# EAGLE design ESP32_sparrow_old_good (EAGLE 9.6.2)

## Sheet 1 of 2
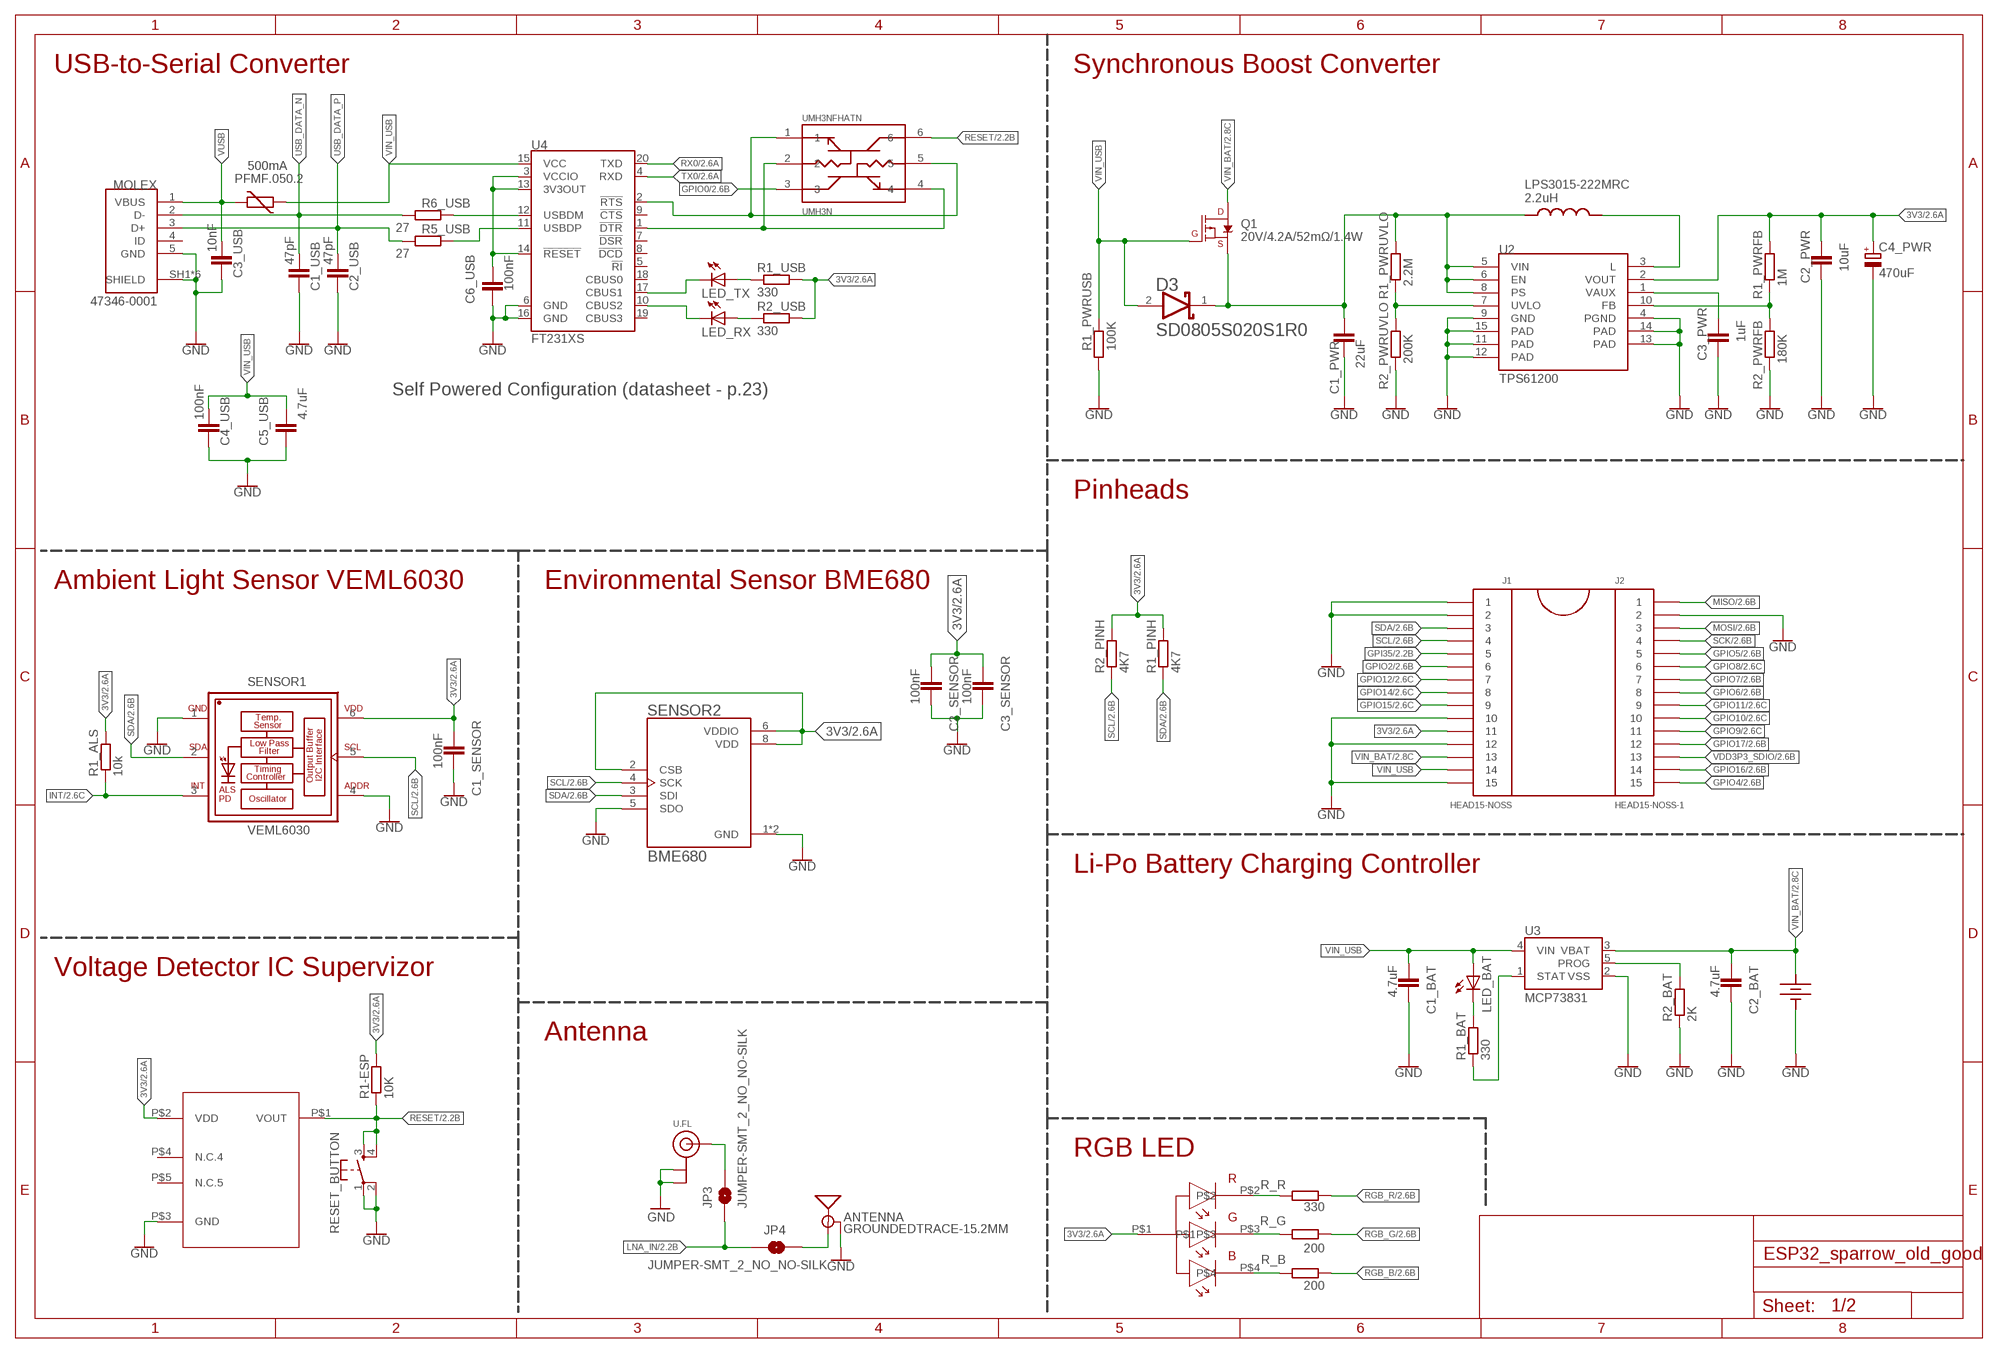
[diagram p0: schematic, sheet 1]

### Parts
ANTENNA  GROUNDEDTRACE-15.2MM  ANTENNA-GROUNDEDTRACE-15.2MM  [TRACE_ANTENNA_2.4GHZ_15.2MM]
C1_BAT  4.7uF  CC0402  [C0402]
C1_PWR  22uF  C-EUC0603  [C0603]
C1_SENSOR  100nF  CC0402  [C0402]
C1_USB  47pF  CC0402  [C0402]
C2_BAT  4.7uF  CC0402  [C0402]
C2_PWR  10uF  CC0402  [C0402]
C2_SENSOR  100nF  CC0402  [C0402]
C2_USB  47pF  CC0402  [C0402]
C3_PWR  1uF  CC0402  [C0402]
C3_SENSOR  100nF  CC0402  [C0402]
C3_USB  10nF  CC0402  [C0402]
C4_PWR  470uF  CPOL-EUD/7343-31R  [D/7343-31R]
C4_USB  100nF  CC0402  [C0402]
C5_USB  4.7uF  CC0402  [C0402]
C6_USB  100nF  CC0402  [C0402]
D3  AVX_SD0805S020S1R0AVX_SD0805S020S1R0_0_0  [AVX_SD0805S020S1R0_0]
J1  HEAD15-NOSS  [HEAD15-NOSS]
J2  HEAD15-NOSS-1  [HEAD15-NOSS-1]
JP3  JUMPER-SMT_2_NO_NO-SILK  [SMT-JUMPER_2_NO_NO-SILK]
JP4  JUMPER-SMT_2_NO_NO-SILK  [SMT-JUMPER_2_NO_NO-SILK]
LED_BAT  LEDCHIP-LED0603  [CHIP-LED0603]
LED_RX  LEDCHIP-LED0603  [CHIP-LED0603]
LED_TX  LEDCHIP-LED0603  [CHIP-LED0603]
MOLEX  47346-0001  [MOLEX_47346-0001]
PFMF.050.2  500mA  VARISTORCN1812  [CT/CN1812]
Q1  20V/4.2A/52mΩ/1.4W  MOSFET_PCH-DMG2305UX-7  [SOT23-3]
R1-ESP  10K  RR0402  [R0402]
R1_ALS  10k  RR0402  [R0402]
R1_BAT  330  RR0402  [R0402]
R1_PINH  4K7  RR0402  [R0402]
R1_PWRFB  1M  RR0402  [R0402]
R1_PWRUSB  100K  RR0402  [R0402]
R1_PWRUVLO  2.2M  RR0402  [R0402]
R1_USB  330  RR0402  [R0402]
R2_BAT  2K  RR0402  [R0402]
R2_PINH  4K7  RR0402  [R0402]
R2_PWRFB  180K  RR0402  [R0402]
R2_PWRUVLO  200K  RR0402  [R0402]
R2_USB  330  RR0402  [R0402]
R5_USB  27  RR0402  [R0402]
R6_USB  27  RR0402  [R0402]
R_B  200  RR0402  [R0402]
R_G  200  RR0402  [R0402]
R_R  330  RR0402  [R0402]
RESET_BUTTON  MOMENTARY-SWITCH-SPST-2-SMD-4.6X2.8MM  [TACTILE_SWITCH_SMD_4.6X2.8MM]
SENSOR1  VEML6030  [VISHAY_VEML6030_2X2X0.87]
SENSOR2  BME680  [PSON80P300X300X100-8N]
U2  TPS61200  [QFN-10_PAD]
U3  MCP73831  [SOT23-5]
U4  FT231XS  [SSOP20_L]
U$1  150202M153130-RGB  [150202M153130]
U$2  BD48E27G-TR  [SSOP5]
U$4  12BHC186CLP-GR  [12BHC186CLP-GR]
U$5  LPS3015  [LPS3015-222MRC]
U.FL  ANTENNA_U.FL  [U.FL]
UMH3NFHATN  UMH3NFHATN  UMH3N  [SOP65P210X100-6N]

### Nets
3V3: C1_SENSOR.2 C2_PWR.2 C2_SENSOR.2 C3_SENSOR.2 C4_PWR.+ J1.11 R1-ESP.2 R1_ALS.2 R1_PINH.2 R1_PWRFB.2 R1_USB.2 R2_PINH.2 R2_USB.2 SENSOR1.6(VDD) SENSOR2.2(CSB) SENSOR2.6(VDDIO) SENSOR2.8(VDD) U2.2(VOUT) U$1.P$1 U$2.P$2(VDD) ; also sheet 2
GND: ANTENNA.GND C1_BAT.1 C1_PWR.2 C1_SENSOR.1 C1_USB.2 C2_BAT.1 C2_PWR.1 C2_SENSOR.1 C2_USB.2 C3_PWR.1 C3_SENSOR.1 C3_USB.2 C4_PWR.- C4_USB.2 C5_USB.2 C6_USB.2 J1.1 J1.2 J1.10 J1.12 J1.15 J2.2 MOLEX.5(GND) MOLEX.SH1(SHIELD) MOLEX.SH2(SHIELD) MOLEX.SH3(SHIELD) MOLEX.SH4(SHIELD) MOLEX.SH5(SHIELD) MOLEX.SH6(SHIELD) R1_PWRUSB.1 R2_BAT.1 R2_PWRFB.1 R2_PWRUVLO.1 RESET_BUTTON.1 RESET_BUTTON.2 SENSOR1.1(GND) SENSOR1.4(ADDR) SENSOR2.1(GND) SENSOR2.5(SDO) SENSOR2.7(GND) U2.4(PGND) U2.9(GND) U2.11(PAD) U2.12(PAD) U2.13(PAD) U2.14(PAD) U2.15(PAD) U3.2(VSS) U4.6(GND) U4.16(GND) U$2.P$3(GND) U$4.P$1(G) U$4.P$3(G) U$4.P$4(G) U.FL.1(GND) U.FL.2(GND) ; also sheet 2
GPI35: J1.5 ; also sheet 2
GPIO0: UMH3NFHATN.3 ; also sheet 2
GPIO2: J1.6 ; also sheet 2
GPIO4: J2.15 ; also sheet 2
GPIO5: J2.5 ; also sheet 2
GPIO6: J2.8 ; also sheet 2
GPIO7: J2.7 ; also sheet 2
GPIO8: J2.6 ; also sheet 2
GPIO9: J2.11 ; also sheet 2
GPIO10: J2.10 ; also sheet 2
GPIO11: J2.9 ; also sheet 2
GPIO12: J1.7 ; also sheet 2
GPIO14: J1.8 ; also sheet 2
GPIO15: J1.9 ; also sheet 2
GPIO16: J2.14 ; also sheet 2
GPIO17: J2.12 ; also sheet 2
INT: R1_ALS.1 SENSOR1.3(INT) ; also sheet 2
LNA_IN: JP3.1 JP4.1 ; also sheet 2
MISO: J2.1 ; also sheet 2
MOSI: J2.3 ; also sheet 2
N$1: R1_PWRFB.1 R2_PWRFB.2 U2.10(FB)
N$3: R_B.2 U$1.P$4
N$4: R_G.2 U$1.P$3
N$5: R_R.2 U$1.P$2
N$6: U4.1(!DTR) UMH3NFHATN.2 UMH3NFHATN.4
N$7: U4.2(!RTS) UMH3NFHATN.1 UMH3NFHATN.5
N$8: ANTENNA.ANT(SIGNAL) JP4.2
N$9: C6_USB.1 U4.3(VCCIO) U4.13(3V3OUT) U4.14(!RESET)
N$10: R1_PWRUVLO.1 R2_PWRUVLO.2 U2.7(UVLO)
N$12: U2.3(L) U$5.P$2
N$13: LED_BAT.C R1_BAT.2
N$15: R1_BAT.1 U3.1(STAT)
N$16: LED_TX.C U4.17(CBUS1)
N$18: JP3.2 U.FL.3(SIGNAL)
N$19: C3_PWR.2 U2.1(VAUX)
N$20: R6_USB.2 U4.12(USBDM)
N$22: LED_TX.A R1_USB.1
N$23: LED_RX.C U4.10(CBUS2)
N$24: LED_RX.A R2_USB.1
N$26: R5_USB.2 U4.11(USBDP)
N$28: R2_BAT.2 U3.5(PROG)
RESET: R1-ESP.1 RESET_BUTTON.3 RESET_BUTTON.4 U$2.P$1(VOUT) UMH3NFHATN.6 ; also sheet 2
RGB_B: R_B.1 ; also sheet 2
RGB_G: R_G.1 ; also sheet 2
RGB_R: R_R.1 ; also sheet 2
RX0: U4.20(TXD) ; also sheet 2
SCK: J2.4 ; also sheet 2
SCL: J1.4 R2_PINH.1 SENSOR1.5(SCL) SENSOR2.4(SCK) ; also sheet 2
SDA: J1.3 R1_PINH.1 SENSOR1.2(SDA) SENSOR2.3(SDI) ; also sheet 2
TX0: U4.4(RXD) ; also sheet 2
USB_DATA_N: C1_USB.1 MOLEX.2(D-) R6_USB.1
USB_DATA_P: C2_USB.1 MOLEX.3(D+) R5_USB.1
VDD3P3_SDIO: J2.13 ; also sheet 2
VIN: C1_PWR.1 D3.1(CATHODE) Q1.2(S) R1_PWRUVLO.2 U2.5(VIN) U2.6(EN) U2.8(PS) U$5.P$1
VIN_BAT: C2_BAT.2 J1.13 Q1.3(D) U3.3(VBAT) U$4.P$2(P) U$4.P$5(P) U$4.P$6(P) ; also sheet 2
VIN_USB: C1_BAT.2 C4_USB.1 C5_USB.1 D3.2(ANODE) J1.14 LED_BAT.A PFMF.050.2.1 Q1.1(G) R1_PWRUSB.2 U3.4(VIN) U4.15(VCC)
VUSB: C3_USB.1 MOLEX.1(VBUS) PFMF.050.2.2
Unconnected: MOLEX.4(ID) U4.5(!RI) U4.7(!DSR) U4.8(!DCD) U4.9(!CTS) U4.18(CBUS0) U4.19(CBUS3) U$2.P$4(N.C.4) U$2.P$5(N.C.5)

### Notes on the sheet
- USB-to-Serial Converter | Synchronous Boost Converter
- Self Powered Configuration (datasheet - p.23)
- Pinheads
- Ambient Light Sensor VEML6030 | Environmental Sensor BME680
- Li-Po Battery Charging Controller
- Voltage Detector IC Supervizor
- Antenna
- RGB LED

## Sheet 2 of 2
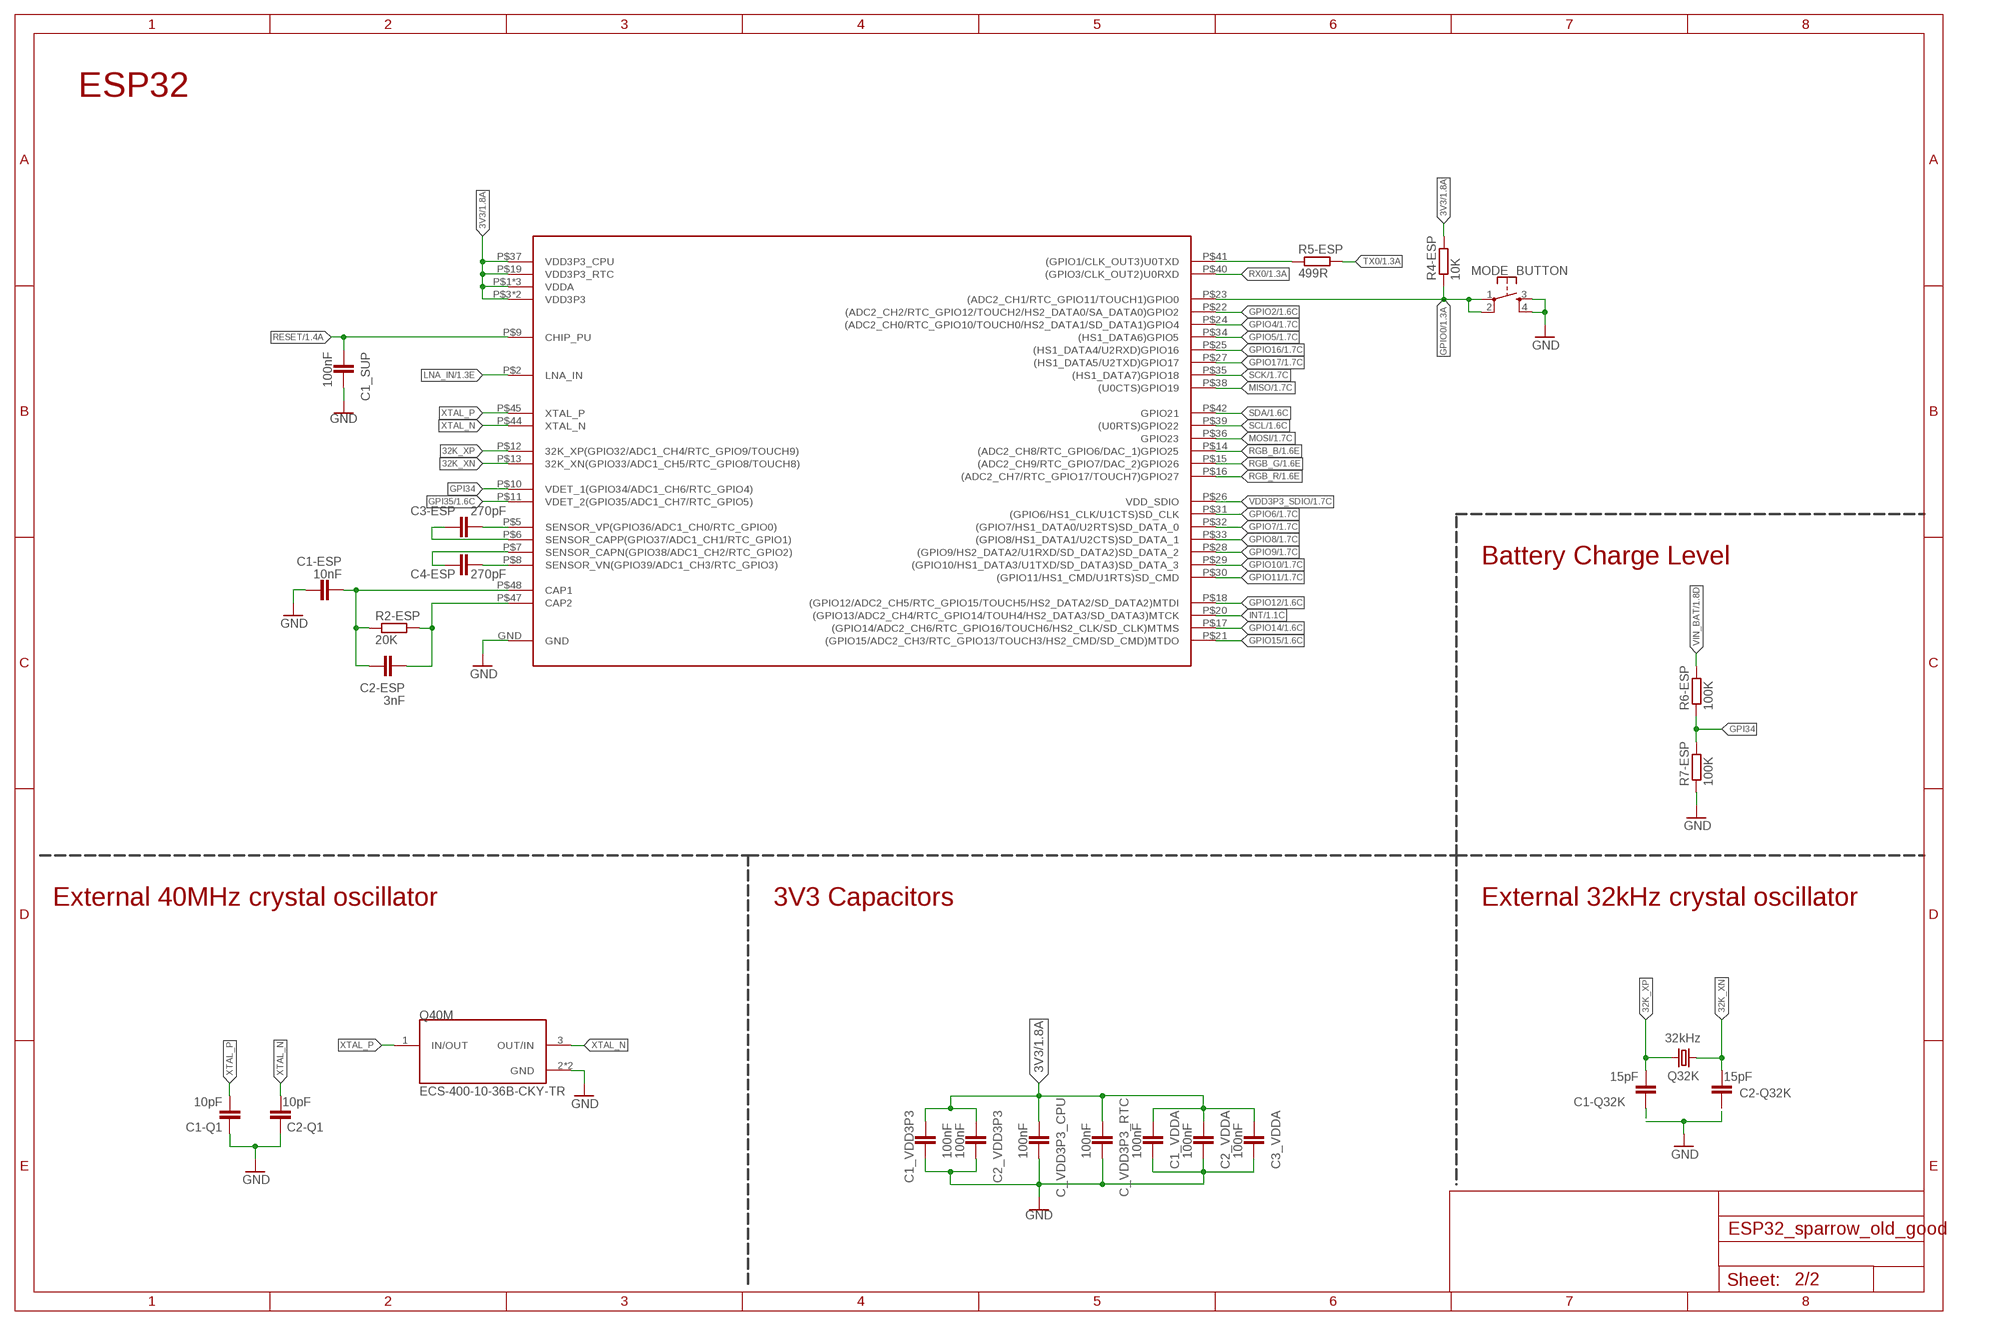
[diagram p1: schematic, sheet 2]

### Parts
C1-ESP  10nF  CC0402  [C0402]
C1-Q1  10pF  CC0402  [C0402]
C1-Q32K  15pF  CC0402  [C0402]
C1_SUP  100nF  CC0402  [C0402]
C1_VDD3P3  100nF  CC0402  [C0402]
C1_VDDA  100nF  CC0402  [C0402]
C2-ESP  3nF  CC0402  [C0402]
C2-Q1  10pF  CC0402  [C0402]
C2-Q32K  15pF  CC0402  [C0402]
C2_VDD3P3  100nF  CC0402  [C0402]
C2_VDDA  100nF  CC0402  [C0402]
C3-ESP  270pF  CC0402  [C0402]
C3_VDDA  100nF  CC0402  [C0402]
C4-ESP  270pF  CC0402  [C0402]
C_VDD3P3_CPU  100nF  CC0402  [C0402]
C_VDD3P3_RTC  100nF  CC0402  [C0402]
MODE_BUTTON  MOMENTARY-SWITCH-SPST-2-SMD-4.6X2.8MM  [TACTILE_SWITCH_SMD_4.6X2.8MM]
Q32K  32kHz  FC-12M  [FC-12M]
Q40M  ECS-400-10-36B-CKY-TR  [XTAL_ECS-163.84-10-36-JGN-TR]
R2-ESP  20K  RR0402  [R0402]
R4-ESP  10K  RR0402  [R0402]
R5-ESP  499R  RR0402  [R0402]
R6-ESP  100K  RR0402  [R0402]
R7-ESP  100K  RR0402  [R0402]
U$3  ESP32-U4WDH  [ESP32-U4WDH]

### Nets
3V3: C1_VDD3P3.2 C1_VDDA.2 C2_VDD3P3.2 C2_VDDA.2 C3_VDDA.2 C_VDD3P3_CPU.2 C_VDD3P3_RTC.2 R4-ESP.2 U$3.P$1(VDDA) U$3.P$3(VDD3P3) U$3.P$4(VDD3P3) U$3.P$19(VDD3P3_RTC) U$3.P$37(VDD3P3_CPU) U$3.P$43(VDDA) U$3.P$46(VDDA) ; also sheet 1
32K_XN: C2-Q32K.2 Q32K.1 U$3.P$13(32K_XN(GPIO33/ADC1_CH5/RTC_GPIO8/TOUCH8))
32K_XP: C1-Q32K.2 Q32K.2 U$3.P$12(32K_XP(GPIO32/ADC1_CH4/RTC_GPIO9/TOUCH9))
GND: C1-ESP.1 C1-Q1.1 C1-Q32K.1 C1_SUP.1 C1_VDD3P3.1 C1_VDDA.1 C2-Q1.1 C2-Q32K.1 C2_VDD3P3.1 C2_VDDA.1 C3_VDDA.1 C_VDD3P3_CPU.1 C_VDD3P3_RTC.1 MODE_BUTTON.3 MODE_BUTTON.4 Q40M.2(GND) Q40M.4(GND) R7-ESP.1 U$3.GND ; also sheet 1
GPI34: R6-ESP.1 R7-ESP.2 U$3.P$10(VDET_1(GPIO34/ADC1_CH6/RTC_GPIO4))
GPI35: U$3.P$11(VDET_2(GPIO35/ADC1_CH7/RTC_GPIO5)) ; also sheet 1
GPIO0: MODE_BUTTON.1 MODE_BUTTON.2 R4-ESP.1 U$3.P$23((ADC2_CH1/RTC_GPIO11/TOUCH1)GPIO0) ; also sheet 1
GPIO2: U$3.P$22((ADC2_CH2/RTC_GPIO12/TOUCH2/HS2_DATA0/SA_DATA0)GPIO2) ; also sheet 1
GPIO4: U$3.P$24((ADC2_CH0/RTC_GPIO10/TOUCH0/HS2_DATA1/SD_DATA1)GPIO4) ; also sheet 1
GPIO5: U$3.P$34((HS1_DATA6)GPIO5) ; also sheet 1
GPIO6: U$3.P$31((GPIO6/HS1_CLK/U1CTS)SD_CLK) ; also sheet 1
GPIO7: U$3.P$32((GPIO7/HS1_DATA0/U2RTS)SD_DATA_0) ; also sheet 1
GPIO8: U$3.P$33((GPIO8/HS1_DATA1/U2CTS)SD_DATA_1) ; also sheet 1
GPIO9: U$3.P$28((GPIO9/HS2_DATA2/U1RXD/SD_DATA2)SD_DATA_2) ; also sheet 1
GPIO10: U$3.P$29((GPIO10/HS1_DATA3/U1TXD/SD_DATA3)SD_DATA_3) ; also sheet 1
GPIO11: U$3.P$30((GPIO11/HS1_CMD/U1RTS)SD_CMD) ; also sheet 1
GPIO12: U$3.P$18((GPIO12/ADC2_CH5/RTC_GPIO15/TOUCH5/HS2_DATA2/SD_DATA2)MTDI) ; also sheet 1
GPIO14: U$3.P$17((GPIO14/ADC2_CH6/RTC_GPIO16/TOUCH6/HS2_CLK/SD_CLK)MTMS) ; also sheet 1
GPIO15: U$3.P$21((GPIO15/ADC2_CH3/RTC_GPIO13/TOUCH3/HS2_CMD/SD_CMD)MTDO) ; also sheet 1
GPIO16: U$3.P$25((HS1_DATA4/U2RXD)GPIO16) ; also sheet 1
GPIO17: U$3.P$27((HS1_DATA5/U2TXD)GPIO17) ; also sheet 1
INT: U$3.P$20((GPIO13/ADC2_CH4/RTC_GPIO14/TOUH4/HS2_DATA3/SD_DATA3)MTCK) ; also sheet 1
LNA_IN: U$3.P$2(LNA_IN) ; also sheet 1
MISO: U$3.P$38((U0CTS)GPIO19) ; also sheet 1
MOSI: U$3.P$36(GPIO23) ; also sheet 1
N$2: R5-ESP.1 U$3.P$41((GPIO1/CLK_OUT3)U0TXD)
N$11: C1-ESP.2 C2-ESP.1 R2-ESP.1 U$3.P$48(CAP1)
N$14: C2-ESP.2 R2-ESP.2 U$3.P$47(CAP2)
N$34: C3-ESP.1 U$3.P$6(SENSOR_CAPP(GPIO37/ADC1_CH1/RTC_GPIO1))
N$35: C3-ESP.2 U$3.P$5(SENSOR_VP(GPIO36/ADC1_CH0/RTC_GPIO0))
N$36: C4-ESP.1 U$3.P$7(SENSOR_CAPN(GPIO38/ADC1_CH2/RTC_GPIO2))
N$38: C4-ESP.2 U$3.P$8(SENSOR_VN(GPIO39/ADC1_CH3/RTC_GPIO3))
RESET: C1_SUP.2 U$3.P$9(CHIP_PU) ; also sheet 1
RGB_B: U$3.P$14((ADC2_CH8/RTC_GPIO6/DAC_1)GPIO25) ; also sheet 1
RGB_G: U$3.P$15((ADC2_CH9/RTC_GPIO7/DAC_2)GPIO26) ; also sheet 1
RGB_R: U$3.P$16((ADC2_CH7/RTC_GPIO17/TOUCH7)GPIO27) ; also sheet 1
RX0: U$3.P$40((GPIO3/CLK_OUT2)U0RXD) ; also sheet 1
SCK: U$3.P$35((HS1_DATA7)GPIO18) ; also sheet 1
SCL: U$3.P$39((U0RTS)GPIO22) ; also sheet 1
SDA: U$3.P$42(GPIO21) ; also sheet 1
TX0: R5-ESP.2 ; also sheet 1
VDD3P3_SDIO: U$3.P$26(VDD_SDIO) ; also sheet 1
VIN_BAT: R6-ESP.2 ; also sheet 1
XTAL_N: C2-Q1.2 Q40M.3(OUT/IN) U$3.P$44(XTAL_N)
XTAL_P: C1-Q1.2 Q40M.1(IN/OUT) U$3.P$45(XTAL_P)

### Notes on the sheet
- ESP32
- Battery Charge Level
- External 40MHz crystal oscillator | 3V3 Capacitors | External 32kHz crystal oscillator

## Library data of the parts
ANTENNA = SparkFun-RF:ANTENNA-GROUNDED: Antenna w/ Ground Connection 2.4GHz antennae with signal and ground terminals. TRACE_ANTENNA_2.4GHZ_15.2MM - Meander Trace antenna 15.2 x 5.7mm footprint Based on layout from TI app note AN043 <http://www.ti.com/lit/an/swra117d/swra117d.pdf>. TRACE_ANTENNA_2.4GHZ_25.7MM - Inverted F trace antenna 25.7 x 7.5 mm footprint. Based on layout from TI design note DN0007 <http://www.ti.com/lit/an/swru120b/swru120b.pdf>.
C1-ESP C1-Q1 C1-Q32K C1_BAT C1_SENSOR C1_SUP C1_USB C1_VDD3P3 C1_VDDA C2-ESP C2-Q1 C2-Q32K C2_BAT C2_PWR C2_SENSOR C2_USB C2_VDD3P3 C2_VDDA C3-ESP C3_PWR C3_SENSOR C3_USB C3_VDDA C4-ESP C4_USB C5_USB C6_USB C_VDD3P3_CPU C_VDD3P3_RTC = eagle-ltspice:C: CAPACITOR, European symbol; SPICEMODEL: NONE; SPICEPREFIX: C
C1_PWR = rcl:C-EU: CAPACITOR, European symbol; SPICEPREFIX: C
C4_PWR = rcl:CPOL-EU: POLARIZED CAPACITOR, European symbol; SPICEPREFIX: C
D3 = AVX - SD0805S020S1R0:AVX_SD0805S020S1R0: Schottky Barrier Rectifier Diode; CENTROID_NOT_SPECIFIED: No; DATASHEET: http://datasheets.avx.com/schottky.pdf; DIGIKEY_DESCRIPTION: DIODE SCHOTTKY 20V 1A 0805; DIGIKEY_PART_NUMBER: 478-7800-1-ND; LEAD_FREE: yes; MF: AVX; MOUSER_PART_NUMBER: 581-SD0805S020S1R0; MPN: SD0805S020S1R0; PACKAGE: 0805 (2012 metric); PREFIX: D; ROHS: yes; TEMPERATURE_RANGE_HIGH: +125°C; TEMPERATURE_RANGE_LOW: -55°C
J1 = MyCON2:HEAD15-NOSS
J2 = MyCON2:HEAD15-NOSS-1
JP3 JP4 = SparkFun-Jumpers:JUMPER-SMT_2_NO: Normally open jumper This jumper has two pads in close proximity to each other. Apply solder to close the connection. Round pads are easier to solder for beginners, but are a lot larger. SparkFun Product that uses the round pads: SparkFun EL Sequencer <https://www.sparkfun.com/products/12781>
LED_BAT LED_RX LED_TX = adafruit:LED: LED OSRAM: - CHIPLED LG R971, LG N971, LY N971, LG Q971, LY Q971, LO R971, LY R971 LH N974, LH R974 LS Q976, LO Q976, LY Q976 LO Q996 - Hyper CHIPLED LW Q18S LB Q993, LB Q99A, LB R99A - SideLED LS A670, LO A670, LY A670, LG A670, LP A670 LB A673, LV A673, LT A673, LW A673 LH A674 LY A675 LS A676, LA A676, LO A676, LY A676, LW A676 LS A679, LY A679, LG A679 - Hyper Micro SIDELED® LS Y876, LA Y876, LO Y876, LY Y876 LT Y87S - SmartLED LW L88C, LW L88S LB L89C, LB L89S, LG L890 LS L89K, LO L89K, LY L89K LS L896, LA L896, LO L896, LY L896 - TOPLED LS T670, LO T670, LY T670, LG T670, LP T670 LSG T670, LSP T670, LSY T670, LOP T670, LYG T670 LG T671, LOG T671, LSG T671 LB T673, LV T673, LT T673, LW T673 LH T674 LS T676, LA T676, LO T676, LY T676, LB T676, LH T676, LSB T676, LW T676 LB T67C, LV T67C, LT T67C, LS T67K, LO T67K, LY T67K, LW E67C LS E67B, LA E67B, LO E67B, LY E67B, LB E67C, LV E67C, LT E67C LW T67C LS T679, LY T679, LG T679 LS T770, LO T770, LY T770, LG T770, LP T770 LB T773, LV T773, LT T773, LW T773 LH T774 LS E675, LA E675, LY E675, LS T675 LS T776, LA T776, LO T776, LY T776, LB T776 LHGB T686 LT T68C, LB T68C - Hyper Mini TOPLED® LB M676 - Mini TOPLED Santana® LG M470 LS M47K, LO M47K, LY M47K Source: http://www.osram.convergy.de/
MODE_BUTTON RESET_BUTTON = SparkFun-Switches:MOMENTARY-SWITCH-SPST-2: Momentary Switch (Pushbutton) - SPST - Two Circuits Normally-open (NO) SPST momentary switches (buttons, pushbuttons). Schematic symbol includes two switch circuits. Variants SMD-4.6MMX2.8MM - 4.60mm x 2.80mm Tactile Momentary Button Switch - Used on SparkFun SAMD21 Mini Breakout <https://www.sparkfun.com/products/13664> SMD-5.2MM - Mini Pushbutton Switch - SMD <https://www.sparkfun.com/products/8720> - Used on Arduino Pro Mini <https://www.sparkfun.com/products/11114>; PROD_ID: SWCH-13065
MOLEX = 47346-0001:47346-0001: CONN RCPT 5POS MICRO USB R/A SMD Check prices <https://pricing.snapeda.com/parts/47346-0001/Molex/view-part?ref=eda>; AVAILABILITY: Warning; DESCRIPTION: USB - micro B USB 2.0 Receptacle Connector 5 Position Surface Mount, Right Angle; MF: Molex; MP: 47346-0001; PACKAGE: None; PRICE: None
PFMF.050.2 = varistor:VARISTOR: VARISTOR
Q1 = SparkFun-DiscreteSemi:MOSFET_PCH: P-channel MOSFETs Voltage controlled devices that allow control of high current outputs. SparkFun Products: SparkFun ESP32 Thing <https://www.sparkfun.com/products/13907> SparkFun ESP8266 Thing <https://www.sparkfun.com/products/13231> SparkFun Pi Servo HAT V2 <https://www.sparkfun.com/products/15316> DMG2305UX-7 (20V/4.2A/SOT23-3); PROD_ID: TRAN-14388
Q32K = crystal:FC-12M: kHz RANGE CRYSTAL UNIT LOW PROFILE SMD Source: Epson Toyocom FC-12M.pdf
Q40M = ECS-400-10-36B-CKY-TR:ECS-400-10-36B-CKY-TR: The minature ECX-2236 is a compact SMD Crystal. The industry standard 2.5 x 2.0 x 0.55 mm ceramic package is ideal for today’s SMD manufacturing environment. Check prices <https://pricing.snapeda.com/parts/ECS-400-10-36B-CKY-TR/ECS%20Inc./view-part?ref=eda>; AVAILABILITY: Warning; DESCRIPTION: 40MHz ±10ppm Crystal 10pF 30 Ohms 4-SMD, No Lead; MF: ECS Inc.; MP: ECS-400-10-36B-CKY-TR; PACKAGE: SMD-4 ECS International; PRICE: None; PURCHASE-URL: https://pricing.snapeda.com/search/part/ECS-400-10-36B-CKY-TR/?ref=eda
R1-ESP R1_ALS R1_BAT R1_PINH R1_PWRFB R1_PWRUSB R1_PWRUVLO R1_USB R2-ESP R2_BAT R2_PINH R2_PWRFB R2_PWRUVLO R2_USB R4-ESP R5-ESP R5_USB R6-ESP R6_USB R7-ESP R_B R_G R_R = eagle-ltspice:R: RESISTOR, European symbol; SPICEMODEL: NONE; SPICEPREFIX: R
SENSOR1 = VEML6030:VEML6030: VEML6030 High Accuracy Ambient Light Sensor with I2C Interface: VEML6030 is a high accuracy ambient light digital 16-bit resolution sensor in a miniature transparent 2 mm x 2 mm package. It includes a high sensitive photodiode, a low noise amplifier, a 16-bit A/D converter and supports an easy to use I2C bus communication interface and additional interrupt feature. The ambient light result is as digital value available. Device Model created 15.06.2016 by Johannes Kolb - Vishay Semiconductor GmbH Check prices <https://pricing.snapeda.com/parts/VEML6030/Vishay/view-part?ref=eda>; AVAILABILITY: In Stock; DESCRIPTION: Optical Sensor Ambient 550nm I²C 6-SMD, No Lead; MF: Vishay; MP: VEML6030; PACKAGE: SMD-6 Vishay; PRICE: None
SENSOR2 = BME680:BME680: Integrated Environmental Unit; AVAILABILITY: Unavailable; DESCRIPTION: Integrated Environmental Unit; MF: Bosch Sensortec; MP: BME680; PACKAGE: LGA-8 Bosch Tools; PRICE: None
U2 = SparkFun-IC-Power:TPS61200: DC to DC Booster IC-10035; PROD_ID: IC-10035
U3 = SparkFun-IC-Power:MCP73831: MCP73831T Li-Ion, Li-Pol Controller Miniature single cell, fully integrated Li-Ion, Li-polymer charge management controller Datasheet <http://ww1.microchip.com/downloads/en/DeviceDoc/20001984g.pdf> SparkFun Products: SparkFun ESP32 Thing <https://www.sparkfun.com/products/13907> SparkFun 9DoF Razor IMU M0 <https://www.sparkfun.com/products/14001>; PROD_ID: IC-09995
U4 = SparkFun-IC-Comms:FT231X: FTDI FT231X Full Speed USB to Full-handshake UART This USB2.0 Full Speed IC offers a compact bridge to full handshake UART interfaces. The device is a UART, capable of operating up to 3MBaud, with low power consumption (8mA). The FT231X includes the complete FT-X series feature set and enables USB to be added into a system design quickly and easily over a UART interface. Datasheet <http://cdn.sparkfun.com/datasheets/Components/General%20IC/DS_FT231X.pdf> SparkFun Products SparkFun RedBoard - Programmed with Arduino <https://www.sparkfun.com/products/12757> (DEV-12757) SparkFun XBee Explorer USB <https://www.sparkfun.com/products/11812> (WRL-11812) SparkFun XBee Explorer Dongle <https://www.sparkfun.com/products/11697> (WRL-11697) SparkFun Blynk Board - ESP8266 <https://www.sparkfun.com/products/13794> (WRL-13794) SparkFun ESP8266 Thing - Dev Board <https://www.sparkfun.com/products/13711> (WRL-13711) SparkFun Block for Intel® Edison - Base <https://www.sparkfun.com/products/13045> (DEV-13045) SparkFun RedStick <https://www.sparkfun.com/products/13741> (DEV-13741) SparkFun Beefy 3 - FTDI Basic Breakout <https://www.sparkfun.com/products/13746> (DEV-13746) SparkFun FT231X Breakout <https://www.sparkfun.com/products/11736> (BOB-11736); PROD_ID: IC-11524
U$1 = 150202M153130:150202M153130-RGB
U$2 = BD48E27G-TR:BD48E27G-TR
U$3 = my_esp32:ESP32-U4WDH
U$4 = 12BHC186CLP-GR:12BHC186CLP-GR
U$5 = LPS3015:LPS3015
U.FL = adafruit:ANTENNA_U.FL: U.FL Antenna Connector
UMH3NFHATN = UMH3N:UMH3N: Dual PNP/NPN transistor for chip reset; AVAILABILITY: Unavailable; DESCRIPTION: Pre-Biased Bipolar Transistor (BJT) 2 NPN - Pre-Biased (Dual) 50V 100mA 250MHz 150mW Surface Mount UMT6; MF: Rohm; MP: UMH3N; PACKAGE: SOT-363 Rohm; PRICE: None

## Board
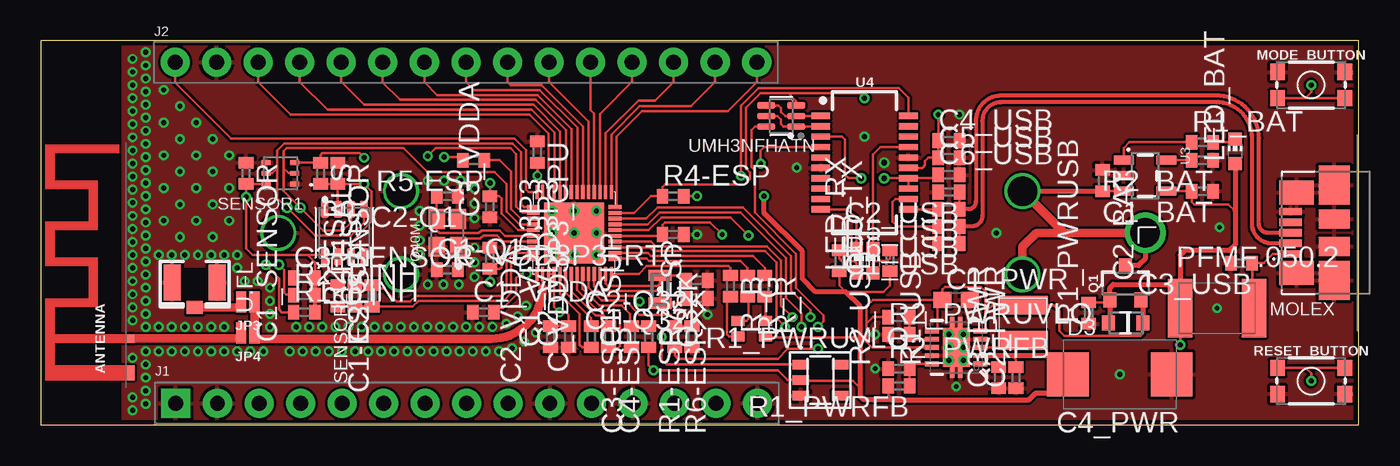
[diagram p2: board, top side]
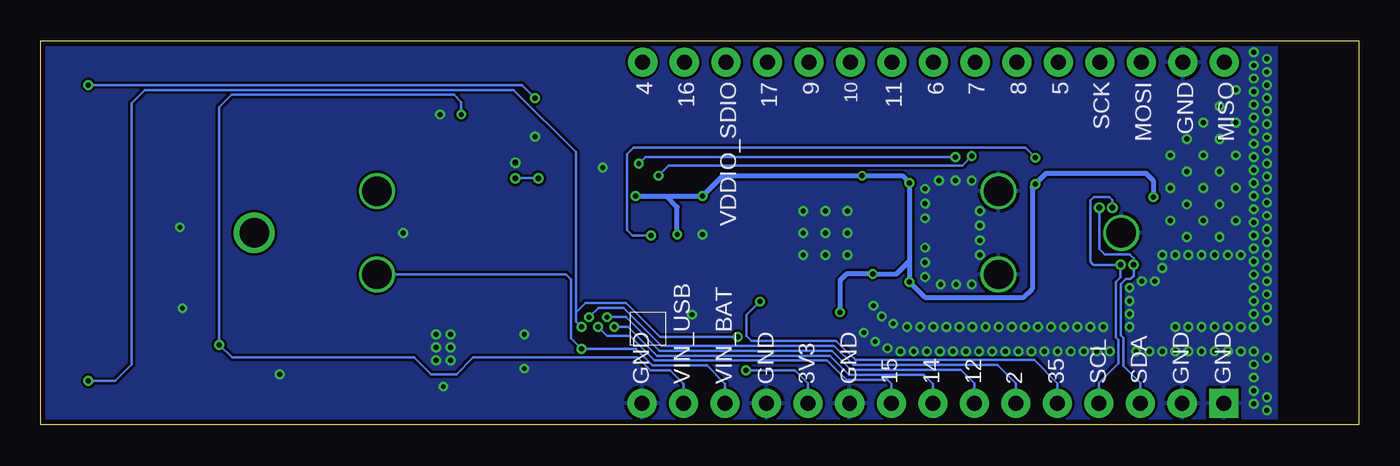
[diagram p3: board, bottom side, seen from below]

Size 80.55 x 23.5 mm. Coordinates in mm from the lower left corner, seen from the top.
Outline: 0,0 80.55,0 80.55,23.5 0,23.5 0,0
Copper layers (1*16): Top 0.035mm / dielectric 1.5mm / Bottom 0.035mm
Design rules "PCB-POOL Standard": minimum track width 0.15mm, minimum drill 0.3mm, track to track 0.15mm, track to pad 0.15mm, pad to pad 0.15mm, via to via 0.15mm, smd to smd 0.15mm, copper to edge 0.3mm, drill to drill 0.2mm, minimum pad ring 0.2mm, minimum via ring 0.15mm, stop-mask expansion 0.03mm, vias tented up to drill 0mil, thermal gap 0.2mm

### Footprints (pad centres in the part's own frame; a part is rotated, then mirrored left to right if it is on the bottom)
TRACE_ANTENNA_2.4GHZ_15.2MM = smd 0.5 x 0.5: ANT 0,-0.25 | smd 0.9 x 0.5: GND -2.1,-0.25
C0402 = smd 0.7 x 0.9: 1 -0.65,0; 2 0.65,0
C0603 = smd 1.1 x 1: 1 -0.85,0; 2 0.85,0
D/7343-31R = smd 2.55 x 2.7: + 3.175,0; - -3.175,0
AVX_SD0805S020S1R0_0 = smd 0.8 x 0.9: 1 -1.05,0; 2 1.05,0
HEAD15-NOSS = drill 0.914 pad 1.778 square: 1 0,0 | drill 0.914 pad 1.778: 2 2.54,0; 3 5.08,0; 4 7.62,0; 5 10.16,0; 6 12.7,0; 7 15.24,0; 8 17.78,0; 9 20.32,0; 10 22.86,0; 11 25.4,0; 12 27.94,0; 13 30.48,0; 14 33.02,0; 15 35.56,0
HEAD15-NOSS-1 = drill 0.914 pad 1.778: 1 0,0; 2 2.54,0; 3 5.08,0; 4 7.62,0; 5 10.16,0; 6 12.7,0; 7 15.24,0; 8 17.78,0; 9 20.32,0; 10 22.86,0; 11 25.4,0; 12 27.94,0; 13 30.48,0; 14 33.02,0; 15 35.56,0
SMT-JUMPER_2_NO_NO-SILK = smd 0.635 x 1.27: 1 -0.406,0; 2 0.406,0
CHIP-LED0603 = smd 0.8 x 0.8: A 0,-0.75; C 0,0.75
TACTILE_SWITCH_SMD_4.6X2.8MM = smd 0.9 x 1: 1 -2.05,-0.8; 2 2.05,-0.8; 3 2.05,0.8; 4 -2.05,0.8
MOLEX_47346-0001 = smd 0.45 x 1.38: 1 -1.3,2.66; 2 -0.65,2.66; 3 0,2.66; 4 0.65,2.66; 5 1.3,2.66 | smd 1.475 x 2.1: SH1 -2.462,2.3; SH2 2.462,2.3 | smd 2.375 x 1.9: SH3 -2.913,0; SH6 2.913,0 | smd 1.175 x 1.9: SH4 -0.838,0; SH5 0.838,0
CT/CN1812 = smd 1.5 x 3.6: 1 -2.25,0; 2 2.25,0
SOT23-3 = smd 0.8 x 0.9: 1 -0.95,-1; 2 0.95,-1; 3 0,1.1
FC-12M = smd 0.7 x 1.4: 1 -0.85,0; 2 0.85,0
XTAL_ECS-163.84-10-36-JGN-TR = smd 1.2 x 1: 1 -0.85,-0.65; 2 0.85,-0.65; 3 0.85,0.65; 4 -0.85,0.65
R0402 = smd 0.7 x 0.9: 1 -0.65,0; 2 0.65,0
VISHAY_VEML6030_2X2X0.87 = smd 0.55 x 0.3: 1 -0.875,0.65; 2 -0.875,0; 3 -0.875,-0.65; 4 0.875,-0.65; 5 0.875,0; 6 0.875,0.65
PSON80P300X300X100-8N = smd 1.016 x 0.5: 1 1.458,1.2; 2 1.458,0.4; 3 1.458,-0.4; 4 1.458,-1.2; 5 -1.458,-1.22; 6 -1.458,-0.4; 7 -1.458,0.4; 8 -1.458,1.2
QFN-10_PAD = smd 0.297 x 0.85: 1 -1,-1.475; 2 -0.5,-1.475; 3 0,-1.475; 4 0.5,-1.475; 5 1,-1.475; 6 1,1.475; 7 0.5,1.475; 8 0,1.475; 9 -0.5,1.475; 10 -1,1.475 | smd 0.7 x 0.28: 11 -1.5,0.25; 12 -1.5,-0.25; 13 1.5,0.25; 14 1.5,-0.25 | smd 2.4 x 1.65: 15 0,0
SOT23-5 = smd 0.55 x 1.2: 1 -0.95,-1.3; 2 0,-1.3; 3 0.95,-1.3; 4 0.95,1.3; 5 -0.95,1.3
SSOP20_L = smd 0.381 x 1.143: 1 -2.857,-2.68; 2 -2.223,-2.68; 3 -1.587,-2.68; 4 -0.953,-2.68; 5 -0.318,-2.68; 6 0.318,-2.68; 7 0.953,-2.68; 8 1.587,-2.68; 9 2.223,-2.68; 10 2.857,-2.68; 11 2.857,2.68; 12 2.223,2.68; 13 1.587,2.68; 14 0.953,2.68; 15 0.318,2.68; 16 -0.318,2.68; 17 -0.953,2.68; 18 -1.587,2.68; 19 -2.223,2.68; 20 -2.857,2.68
150202M153130 = smd 0.8 x 0.6: P$1 -0.85,0.475; P$2 -0.85,-0.475; P$3 0.85,-0.475; P$4 0.85,0.475
SSOP5 = smd 0.6 x 1: P$1 -0.95,-0.8; P$2 0,-0.8; P$3 0.95,-0.8; P$4 0.95,1.6; P$5 -0.95,1.6
ESP32-U4WDH = smd 3.7 x 3.7: GND 0,0 | smd 0.2 x 0.8: P$1 -2.275,-2.5; P$2 -1.925,-2.5; P$3 -1.575,-2.5; P$4 -1.225,-2.5; P$5 -0.875,-2.5; P$6 -0.525,-2.5; P$7 -0.175,-2.5; P$8 0.175,-2.5; P$9 0.525,-2.5; P$10 0.875,-2.5; P$11 1.225,-2.5; P$12 1.575,-2.5; P$13 1.925,-2.5; P$14 2.275,-2.5; P$25 2.275,2.5; P$26 1.925,2.5; P$27 1.575,2.5; P$28 1.225,2.5; P$29 0.875,2.5; P$30 0.525,2.5; P$31 0.175,2.5; P$32 -0.175,2.5; P$33 -0.525,2.5; P$34 -0.875,2.5; P$35 -1.225,2.5; P$36 -1.575,2.5; P$37 -1.925,2.5; P$38 -2.275,2.5 | smd 0.8 x 0.2: P$15 2.5,-1.575; P$16 2.5,-1.225; P$17 2.5,-0.875; P$18 2.5,-0.525; P$19 2.5,-0.175; P$20 2.5,0.175; P$21 2.5,0.525; P$22 2.5,0.875; P$23 2.5,1.225; P$24 2.5,1.575; P$39 -2.5,1.575; P$40 -2.5,1.225; P$41 -2.5,0.875; P$42 -2.5,0.525; P$43 -2.5,0.175; P$44 -2.5,-0.175; P$45 -2.5,-0.525; P$46 -2.5,-0.875; P$47 -2.5,-1.225; P$48 -2.5,-1.575
12BHC186CLP-GR = drill 1.8: P$1 -26.5,0; P$3 -19,2.55; P$4 -19,-2.55; P$5 19,2.55; P$6 19,-2.55 | drill 1.8 pad 2.5: P$2 26.5,0
LPS3015-222MRC = smd 1.14 x 3.05: P$1 1.075,-0.025; P$2 -1.075,-0.025
U.FL = smd 2.2 x 1.05: 1 0,1.375; 2 0,-1.375 | smd 0.8 x 1: 3 1.525,0
SOP65P210X100-6N = smd 1.09 x 0.4: 1 -0.92,0.65; 2 -0.92,0; 3 -0.92,-0.65; 4 0.92,-0.65; 5 0.92,0; 6 0.92,0.65

### Placement (x,y rotation side)
ANTENNA  5.21,5.29 90 top
C1-ESP  18.15,7.9 270 top
C1-Q1  24.85,9.5 0 top
C1-Q32K  40.1,7.75 180 top
C1_BAT  71,14.3 180 top
C1_PWR  55.95,7.65 0 top
C1_SENSOR  12.55,15.4 270 top
C1_SUP  36.1,5.4 90 top
C1_USB  55.5,11.1 180 top
C1_VDD3P3  31.15,5.4 90 top
C1_VDDA  27.05,6.9 0 top
C2-ESP  20.25,7.9 90 top
C2-Q1  24.85,14 180 top
C2-Q32K  40.1,8.85 180 top
C2_BAT  64.9,14.95 270 top
C2_PWR  59.6,2.9 90 top
C2_SENSOR  18.15,15.4 270 top
C2_USB  55.5,14.25 180 top
C2_VDD3P3  32.25,5.4 90 top
C2_VDDA  27.45,10.2 270 top
C3-ESP  33.65,5.4 270 top
C3_PWR  58.55,2.9 90 top
C3_SENSOR  16.1,9 0 top
C3_USB  73.4,9.9 180 top
C3_VDDA  27.45,13.35 90 top
C4-ESP  34.7,5.4 270 top
C4_PWR  65.95,3.1 180 top
C4_USB  55.5,17.4 0 top
C5_USB  55.5,16.35 0 top
C6_USB  55.5,15.3 0 top
C_VDD3P3_CPU  30.35,16.7 270 top
C_VDD3P3_RTC  38.65,11.65 180 top
D3  66.3,6.25 180 top
J1  8.25,1.34 0 top
J2  8.2,22.19 0 top
JP3  12.65,7.53 180 top
JP4  12.65,5.63 180 top
LED_BAT  73,16.75 0 top
LED_RX  49.85,10.05 0 top
LED_TX  50.85,10.05 0 top
MODE_BUTTON  77.65,20.8 0 top
MOLEX  79.06,11.76 90 top
PFMF.050.2  71.9,7.15 0 top
Q1  66.3,8.65 0 top
Q32K  37.85,8.3 270 top
Q40M  24.85,11.75 90 top
R1-ESP  37.15,5.4 270 top
R1_ALS  17.1,15.4 270 top
R1_BAT  71,17.3 0 top
R1_PINH  16.1,6.9 0 top
R1_PWRFB  52.45,2.4 180 top
R1_PWRUSB  64.05,6.85 90 top
R1_PWRUVLO  52.45,6.6 180 top
R1_USB  51.9,10.05 270 top
R2-ESP  19.2,7.9 90 top
R2_BAT  71,16.2 180 top
R2_PINH  16.1,7.95 0 top
R2_PWRFB  52.45,3.45 0 top
R2_PWRUVLO  52.45,5.55 0 top
R2_USB  48.8,10.05 270 top
R4-ESP  38.65,14 0 top
R5-ESP  26.45,16.2 180 top
R5_USB  55.5,13.2 180 top
R6-ESP  38.75,5.4 270 top
R6_USB  55.5,12.15 180 top
R7-ESP  39.8,5.4 90 top
R_B  42.15,8.5 270 top
R_G  43.2,8.5 270 top
R_R  44.25,8.5 270 top
RESET_BUTTON  77.65,2.7 0 top
SENSOR1  14.65,15.4 180 top
SENSOR2  18.55,11.75 90 top
U2  55.95,4.75 90 top
U3  67.5,15.25 270 top
U4  50.35,16.05 270 top
U$1  43.45,5.9 180 top
U$2  47.25,2.75 270 top
U$3  32.6,11.75 0 top
U$4  41.01,11.76 0 top
U$5  60,6.25 90 top
U.FL  9.4,8.72 270 top
UMH3NFHATN  45.25,18.9 180 top

### Tracks (layer width: path | path; a pad name or v marks a point on that pad's centre or on a via)
3V3  (via drill 0.3)
  Top 0.15: C_VDD3P3_RTC.2 38,12.25 38.15,12.4 | SENSOR1.6 C1_SENSOR.2 | SENSOR2.2 C2_SENSOR.2 R1_ALS.2 | C2_PWR.2 59.6,4 59.35,4.25
  Top 0.152: U$3.P$43 29.18,11.93 28.15,12.95 28.15,13.85 28,14 C3_VDDA.2 v27.45,14.8 | U$3.P$46 28.82,10.88 28.15,10.2 28.15,9.65 28.05,9.55 C2_VDDA.2 v27.45,8.75 | U$3.P$3 U$3.P$4 31.38,7.22 v31.7,6.9 32.1,6.9 32.25,6.75 C2_VDD3P3.2 C1_VDD3P3.2 | U$3.P$37 30.67,14.93 v30.35,15.25 C_VDD3P3_CPU.2 | C1_VDDA.2 27.95,7.15 28.25,7.15 29.06,7.95 29.06,9 29.31,9.25 v29.7,9.25 U$3.P$1 | U$3.P$19 37.92,11.57 C_VDD3P3_RTC.2 | 38.15,12.4 40.9,12.4 v41.65,11.65 | R1-ESP.2 37.15,3.65 v37.45,3.35 45.05,3.35 45.65,2.75 U$2.P$2 46.5,2.7 49.65,2.7 50.1,2.25 | R4-ESP.2 v40.1,14 | 52.1,1.55 51.8,1.85 R1_PWRFB.2 | U$1.P$1 44.35,5.38 49.67,5.38 50.1,4.95 | R2_USB.2 48.8,8.55 49.2,8.15 51.5,8.15 51.9,8.55 R1_USB.2 | C2_SENSOR.2 v19.75,14.75 20.23,14.27 20.23,12.45 18.95,11.17 SENSOR2.6 | C1_SENSOR.2 v12.55,13.95 12.55,10.8 12.96,10.39 16.3,10.39 | SENSOR2.8 17.25,10.39 16.3,10.39 | 16.3,10.39 16.75,9.94 C3_SENSOR.2
  Top 0.254: C3_SENSOR.2 R2_PINH.2 R1_PINH.2
  Top 0.305: U2.2 59.35,4.25 61.62,4.25 C4_PWR.+ 61.62,1.95 60.8,1.95 60.4,1.55 52.1,1.55 50.3,1.55 50.1,1.75 50.1,2.25 50.1,4.95 50.1,6.01 50.1,7.25 49.2,8.15 47.35,8.15 46.54,8.96 46.54,10.63 44.2,12.97 v44.2,14
  Bottom 0.152: v37.45,3.35 34.45,3.35 33.65,2.55 J1.11
  Bottom 0.305: v44.2,14 42.3,14 | 42.3,14 v40.1,14 38.85,15.25 v30.35,15.25 27.9,15.25 v27.45,14.8 27.45,10.05 | 27.45,10.05 v27.45,8.75 26.51,7.81 20.48,7.81 19.95,8.34 19.95,14.55 v19.75,14.75 19.1,15.4 13,15.4 12.55,14.95 v12.55,13.95 | 27.45,10.05 28.25,9.25 v29.7,9.25 31.3,9.25 31.7,8.85 v31.7,6.9 | 42.3,14 41.65,13.35 v41.65,11.65
32K_XN
  Top 0.152: U$3.P$13 34.52,8.65 34.66,8.51 37.71,8.51 37.85,8.65 Q32K.1 39.15,9.15 C2-Q32K.2
32K_XP
  Top 0.152: U$3.P$12 34.17,8.57 34.53,8.21 37.69,8.21 37.85,8.05 Q32K.2 39.15,7.45 C1-Q32K.2
GND  (via drill 0.3, 0.35)
  Top 0.152: U2.13 55.7,5 U2.15 | U2.14 56.2,5 U2.15 | U2.11 55.7,4.5 U2.15 | U2.12 56.2,4.5 U2.15
  other vias: 6.4,22.8 5.6,22.4 6.4,18.8 6.4,18 6.4,19.6 5.6,20 5.6,19.2 6.4,20.4 6.4,21.2 40.1,11.65 5.6,21.6 6.4,22 5.6,20.8 5.6,18.4 5.6,17.6 6.4,17.2 5.6,16.8 6.4,16.4 5.6,16 6.4,15.6 5.6,15.2 6.4,14.8 5.6,14.4 6.4,14 5.6,13.6 7.5,20.5 8.5,19.5 9.5,18.5 10.5,17.5 11.5,16.5 10.5,15.5 11.5,14.5 11.5,12.5 10.5,13.5 7.5,18.5 8.5,17.5 9.5,16.5 7.5,16.5 8.5,15.5 9.5,14.5 7.5,14.5 8.5,13.5 9.5,12.5 10.5,11.5 7.5,12.5 8.5,11.5 6.4,13.2 6.4,12.4 6.4,11.6 6.4,10.8 5.6,12.8 5.6,12 5.6,11.2 5.6,10.4 6.4,10 7.2,10.4 8,10.4 8.8,10.4 9.6,10.4 10.4,10.4 11.2,10.4 12,10.4 12,9.6 12.45,8.8 13.25,8.8 14,8.4 14,7.6 14,6.8 14,6 11.2,6 10.4,6 9.6,6 8.8,6 8,6 7.2,6 6.4,6 5.6,6.4 6.4,6.8 5.6,7.2 6.4,7.6 5.6,9.6 6.4,9.2 6.4,8.4 5.6,8.8 5.6,8 5.6,4.1 6.4,4.5 6.4,3.7 6.4,2.9 6.4,2.1 6.4,1.3 5.6,1.7 5.6,0.9 26.5,12.65 26.5,10.85 26.5,9.95 26.5,9.05 25.55,8.6 24.6,8.6 23.65,8.6 26.5,13.55 26.5,14.45 25.65,14.95 24.65,14.95 23.65,14.95 23.15,13.1 23.15,12.2 23.15,11.3 23.15,10.4 29.65,7.3 30.25,5.65 29.55,5.1 28.8,4.7 28,4.5 27.2,4.5 26.4,4.5 29.15,6.65 28.45,6.2 27.6,6 26.8,6 26,6 25.2,6 24.4,6 23.6,6 22.8,6 22,6 21.2,6 20.4,6 19.6,6 18.8,6 18,6 17.2,6 16.4,6 15.6,6 7.2,4.5 8,4.5 8.8,4.5 9.6,4.5 10.4,4.5 11.2,4.5 12,4.5 12.8,4.5 13.6,4.5 15.2,4.5 16,4.5 16.8,4.5 17.6,4.5 18.4,4.5 19.2,4.5 20,4.5 20.8,4.5 21.6,4.5 22.4,4.5 23.2,4.5 24,4.5 24.8,4.5 25.6,4.5 50.35,17.65 56.15,19 46.2,15.75 58.4,11.75 71.9,7.15 40.75,6.75 55.95,2.35 51,3.45 51,5.55 72.05,12.1 51.55,16.05 32.6,11.75 33.95,10.4 32.6,10.4 31.25,10.4 31.25,11.75 33.95,11.75 33.95,13.1 32.6,13.1 31.25,13.1 55.5,5.55 56.4,5.55 55.5,4.75 56.4,4.75 55.5,3.95 56.4,3.95 65.95,3.1
  pour Top: 5,23.5 5,0 80.5,0 80.5,23.5
  pour Bottom: 5,23.5 5,0 80.5,0 80.5,23.5
GPI34
  Top 0.152: U$3.P$10 33.48,8.41 34.28,7.61 35.74,7.61 36.6,6.75 38.5,6.75 38.75,6.5 R6-ESP.1 R7-ESP.2
GPI35  (via drill 0.3)
  Top 0.152: U$3.P$11 33.83,8.49 34.41,7.91 36.24,7.91 v36.6,7.55
  Bottom 0.152: v36.6,7.55 37.42,6.73 37.42,5.45 37.12,5.15 31.94,5.15 30.77,3.97 19.82,3.97 18.41,2.56 J1.5
GPIO0  (via drill 0.3)
  Top 0.152: U$3.P$23 36.27,12.97 37.3,14 R4-ESP.1 38,14.55 38.15,14.7 43,14.7 43.35,15.05 43.35,15.45 43.1,15.7 43.1,19.43 43.98,20.3 45.7,20.3 | UMH3NFHATN.3 46.17,19.83 45.7,20.3 | 45.7,20.3 50.05,20.3 v50.35,20 | MODE_BUTTON.1 77.3,20 | 77.3,20 MODE_BUTTON.2 | v77.65,20.8 77.65,20.35 77.3,20
  Bottom 0.152: v50.35,20 51.15,20.8 v77.65,20.8
GPIO2  (via drill 0.3)
  Top 0.152: U$3.P$22 37,12.62 37.68,13.31 42.9,13.31 45.86,10.35 45.86,8.24 47.05,7.05 v47.05,6.6
  Bottom 0.152: v47.05,6.6 v47.04,6.6 46.47,7.18 44.93,7.18 42.6,4.85 32.07,4.85 30.89,3.67 22.07,3.67 20.95,2.55 J1.6
GPIO4
  Top 0.152: U$3.P$24 35.18,13.32 35.2,13.35 35.2,17.65 36.75,19.2 42,19.2 43.76,20.96 J2.15
GPIO5
  Top 0.152: U$3.P$34 31.75,14.27 31.75,17.96 30.12,19.59 19.76,19.59 18.36,20.99 J2.5
GPIO6
  Top 0.152: U$3.P$31 32.8,14.27 32.8,18.19 30.49,20.5 26.45,20.5 25.98,20.97 J2.8
GPIO7
  Top 0.152: U$3.P$32 32.45,14.27 32.45,18.11 30.37,20.19 24.21,20.19 23.44,20.96 J2.7
GPIO8
  Top 0.152: U$3.P$33 32.1,14.27 32.1,18.04 30.24,19.89 21.96,19.89 20.9,20.95 J2.6
GPIO9
  Top 0.152: U$3.P$28 33.83,19.05 33.6,19.27 J2.11
GPIO10
  Top 0.152: U$3.P$29 33.48,18.55 31.06,20.96 J2.10
GPIO11
  Top 0.152: U$3.P$30 33.15,14.27 33.15,18.27 30.62,20.8 28.7,20.8 28.52,20.98 J2.9
GPIO12  (via drill 0.3)
  Top 0.152: U$3.P$18 37.3,11.22 37.59,10.94 44.39,10.94 45.25,10.07 45.25,7.3 v45.95,6.6
  Bottom 0.152: v45.95,6.6 44.78,6.6 42.72,4.54 32.2,4.54 31.02,3.37 24.32,3.37 23.49,2.54 J1.7
GPIO14  (via drill 0.3)
  Top 0.152: U$3.P$17 37.23,10.88 37.47,10.63 44.27,10.63 44.95,9.95 44.95,6.55 v45.5,6
  Bottom 0.152: v45.5,6 44.65,6 42.89,4.24 32.32,4.24 31.14,3.07 26.57,3.07 26.03,2.53 J1.8
GPIO15  (via drill 0.3)
  Top 0.152: U$3.P$21 37.08,12.28 37.81,13.01 42.78,13.01 45.56,10.23 45.56,7.76 46.5,6.82 v46.5,6
  Bottom 0.152: v46.5,6 45.95,5.45 44.55,5.45 43.04,3.94 32.49,3.94 31.31,2.76 28.81,2.76 28.57,2.52 J1.9
GPIO16
  Top 0.152: U$3.P$25 34.88,17.77 36.6,19.5 39.75,19.5 41.22,20.97 J2.14
GPIO17
  Top 0.152: U$3.P$27 34.17,19.02 36.14,20.99 J2.12
INT  (via drill 0.3)
  Top 0.15: R1_ALS.1 SENSOR1.3
  Top 0.152: U$3.P$20 37.16,11.93 37.93,12.7 42.15,12.7 v43.25,11.61 v43.25,11.6 | R1_ALS.1 17.1,16.53 17.2,16.63 19.47,16.63 v19.75,16.35
  Bottom 0.152: v43.25,11.6 44.39,11.6 44.73,11.93 44.73,16.57 44.32,16.98 20.38,16.98 v19.75,16.35
LNA_IN
  Top 0.152: U$3.P$2 30.68,8.43
  Top 0.508: JP3.1 JP4.1 13.06,5.43 13.21,5.28 27.53,5.28 arc90 30.68,8.43
MISO
  Top 0.152: U$3.P$38 29.81,14.25 29.66,14.4 29.66,16.82 28.95,17.53 11.62,17.53 8.2,20.95 J2.1
MOSI
  Top 0.152: U$3.P$36 31.02,15.11 31.03,15.11 31.03,17.82 29.87,18.98 15.27,18.98 13.28,20.97 J2.3
N$1
  Top 0.15: R1_PWRFB.1 R2_PWRFB.2 53.1,3.8 53.15,3.75 U2.10
N$2
  Top 0.152: U$3.P$41 29.33,12.62 28.75,13.2 28.75,15.49 28.05,16.2 R5-ESP.1
N$3
  Top 0.152: U$1.P$4 42.08,5.42 41.95,5.55 41.95,7.65 R_B.2
N$4
  Top 0.152: U$1.P$3 43.12,6.38 43.25,6.5 43.25,7.8 R_G.2
N$5
  Top 0.152: R_R.2 44.3,7.8 U$1.P$2
N$6
  Top 0.152: U4.1 UMH3NFHATN.2 45.5,18.9 45.25,19.15 45.25,19.4 45.1,19.55 UMH3NFHATN.4
N$7
  Top 0.152: U4.2 47.65,18.25 UMH3NFHATN.1 45.4,18.25 45.25,18.4 45.25,18.67 45.02,18.9 UMH3NFHATN.5
N$8
  Top 0.508: ANTENNA.ANT 12.1,5.29 12.24,5.43 JP4.2
N$9  (via drill 0.35)
  Top 0.152: U4.14 54.65,15.1 arc90 C6_USB.1 | U4.14 U4.13 | U4.3 48.96,17.64 49.15,17.45 49.15,15.3 49.35,15.1 v50.15,15.1 | U4.14 v51.55,15.1
  Bottom 0.152: v51.55,15.1 v50.15,15.1
N$10
  Top 0.15: U2.7 53.25,5.25 53.1,5.4 R2_PWRUVLO.2 R1_PWRUVLO.1
N$11
  Top 0.15: 23.07,7.6 22.73,7.25 C2-ESP.1
  Top 0.152: U$3.P$48 28.98,10.18 28.75,9.95 28.75,8.08 28.27,7.6 23.07,7.6 | C2-ESP.1 R2-ESP.1 C1-ESP.2
N$12
  Top 0.15: U2.3 59.6,4.75 U$5.P$2
N$13
  Top 0.152: LED_BAT.C 72.8,17.3 R1_BAT.2
N$14
  Top 0.15: 23.05,7.9 22.93,7.9 22.58,7.55 21.75,7.55 20.95,8.35 20.45,8.35 C2-ESP.2
  Top 0.152: U$3.P$47 28.9,10.53 28.45,10.07 28.45,8.2 28.15,7.9 23.05,7.9 | C2-ESP.2 R2-ESP.2
N$15
  Top 0.152: R1_BAT.1 66.55,17.3 66.2,16.95 U3.1
N$16
  Top 0.152: U4.17 51.32,17 50.85,16.53 LED_TX.C
N$18
  Top 0.508: U.FL.3 12.11,7.2 12.24,7.33 JP3.2
N$19
  Top 0.15: U2.1 58.35,3.75 C3_PWR.2
N$20
  Top 0.152: U4.12 52.23,13.83 52.05,13.65 52.05,12.45 52.35,12.15 R6_USB.2
N$22
  Top 0.152: LED_TX.A 50.85,9.9 51,10.05 51.75,10.05 51.9,10.2 R1_USB.1
N$23
  Top 0.152: U4.10 49.31,13.19 49.85,12.65 LED_RX.C
N$24
  Top 0.152: R2_USB.1 48.8,10.2 48.95,10.05 49.7,10.05 49.85,9.9 LED_RX.A
N$26
  Top 0.152: U4.11 R5_USB.2
N$28
  Top 0.152: U3.5 R2_BAT.2
N$34
  Top 0.152: U$3.P$6 32.08,8.1 33.62,6.56 33.62,6.08 C3-ESP.1
N$35
  Top 0.152: C3-ESP.2 33.1,4.75 32.94,4.91 32.94,6.81 31.73,8.03 U$3.P$5
N$36
  Top 0.152: U$3.P$7 32.42,8.18 33.91,6.7 34.4,6.7 34.57,6.53 34.57,6.18 C4-ESP.1
N$38
  Top 0.152: U$3.P$8 32.77,8.26 34.03,7 35.26,7 35.4,6.86 35.4,4.85 35.25,4.7 34.75,4.7 C4-ESP.2
RESET  (via drill 0.3)
  Top 0.152: U$3.P$9 33.12,8.34 34.16,7.3 35.49,7.3 36,6.8 36,6.15 C1_SUP.2 R1-ESP.1 37.75,6.05 37.95,5.85 v37.95,5.4 37.95,3.98 38.23,3.7 U$2.P$1 | UMH3NFHATN.6 43.65,18.25 43.45,18.05 43.45,15.78 43.65,15.58 43.65,12.99 46.16,10.48 46.16,8.38 47.83,6.72 47.83,6.33 v47.5,6 | RESET_BUTTON.4 77.3,3.5 | 77.3,3.5 RESET_BUTTON.3 | v77.65,2.7 77.65,3.15 77.3,3.5
  Bottom 0.152: v47.5,6 47.85,6.35 47.85,6.9 | 47.85,6.9 47.27,7.48 44.78,7.48 42.7,5.4 v37.95,5.4 | 47.85,6.9 47.85,16.7 51.65,20.5 74.2,20.5 75,19.7 75,3.7 76,2.7 v77.65,2.7
RGB_B
  Top 0.152: U$3.P$14 36.55,9.25 37.03,9.73 42.02,9.73 42.15,9.6 R_B.1
RGB_G
  Top 0.152: U$3.P$15 37.02,10.18 37.17,10.03 42.77,10.03 43.2,9.6 R_G.1
RGB_R
  Top 0.152: U$3.P$16 37.1,10.53 37.3,10.33 43.52,10.33 44.25,9.6 R_R.1
RX0  (via drill 0.3)
  Top 0.152: U$3.P$40 30.09,12.99 29.43,12.99 29.06,13.37 29.06,16.57 28.7,16.93 24.13,16.93 v23.65,16.45 | U4.20 53.03,20.02 52.45,20.6 43.85,20.6 42.8,19.55 v42.8,15.25
  Bottom 0.152: v23.65,16.45 v23.66,16.45 24.23,15.87 42.18,15.87 v42.8,15.25
SCK
  Top 0.152: U$3.P$35 31.4,14.27 31.4,17.88 29.99,19.29 17.51,19.29 15.82,20.98 J2.4
SCL  (via drill 0.35)
  Top 0.15: 18.9,17.23 14.88,17.23 14.45,16.8 14.45,15.7 | 14.45,15.7 14.15,15.4 SENSOR1.5 | 14.45,15.7 14.45,13.98 | SENSOR2.4 19.75,12.4 18.95,11.6 16.83,11.6
  Top 0.152: U$3.P$39 29.52,13.32 29.36,13.49 29.36,16.7 28.83,17.23 18.9,17.23 | 14.45,13.98 14.45,13.9 v15.05,13.3 16.75,11.6 16.83,11.6 | R2_PINH.1 15.43,7.97 15.01,7.97 14.87,8.11 14.87,9.48 v14.55,9.8
  Bottom 0.152: v15.05,13.3 15.05,13.75 15.25,13.95 16.18,13.95 16.4,13.73 16.4,10 16.2,9.8 v14.55,9.8 14.55,9.02 14.83,8.74 14.83,5.35 14.67,5.2 14.67,3.78 15.87,2.58 J1.4
SDA  (via drill 0.35)
  Top 0.15: 23.62,15.48 22.17,16.93 15.03,16.93 14.85,16.75 14.85,15.7 15.15,15.4 SENSOR1.2 | 18.95,12.4 SENSOR2.3
  Top 0.152: U$3.P$42 29.25,12.28 28.45,13.07 28.45,14.75 27.72,15.48 23.62,15.48 | R1_PINH.1 14.73,6.9 14.57,7.06 14.57,8.98 v13.75,9.8 | 14.85,15.7 14.85,14.3 v15.85,13.3 17.25,11.9 18.45,11.9 18.95,12.4
  Bottom 0.152: v15.85,13.3 15.85,10.77 15.51,10.43 13.98,10.43 13.75,10.2 v13.75,9.8 13.75,9.13 13.95,8.93 14.22,8.93 14.53,8.62 14.53,5.48 14.37,5.32 14.37,3.62 13.33,2.58 J1.3
TX0  (via drill 0.3)
  Top 0.152: R5-ESP.2 25.6,16.4 v24.65,16.4 | U4.4 44.2,17 44,16.8 v44,16
  Bottom 0.152: v44,16 43.6,16.4 v24.65,16.4
USB_DATA_N
  Top 0.152: C1_USB.1 R6_USB.1
  Top 0.254: MOLEX.2 75.24,11.11 arc-90 74.05,12.3 74.05,17.56 arc90 71.86,19.75 58.7,19.75 arc90 57.55,18.6 57.55,12.8 arc-90 56.9,12.15 R6_USB.1
USB_DATA_P
  Top 0.152: C2_USB.1 R5_USB.1
  Top 0.254: MOLEX.3 74.99,11.76 arc-90 74.45,12.3 74.45,17.56 arc90 71.86,20.15 58.7,20.15 arc90 57.15,18.6 57.15,13.65 arc-90 56.7,13.2 R5_USB.1
VDD3P3_SDIO
  Top 0.152: U$3.P$26 34.52,17.85 36.53,19.85 37.55,19.85 38.68,20.98 J2.13
VIN
  Top 0.15: U2.6 54.73,5.75 54.8,5.83 54.8,7.35 C1_PWR.1 52.25,7.65 | U2.5 57.62,5.75 57.73,5.85 57.73,6.88 58.17,7.33 U$5.P$1 | 50.48,6.22 50.86,6.6 R1_PWRUVLO.2 | U2.8 50.8,4.75 50.48,5.08 50.48,6.17
  Top 0.152: Q1.2 67.35,7.55 | 50.48,6.17 50.48,6.22 50.48,7.28 50.85,7.65 52.25,7.65 | C1_PWR.1 55.1,8.3 55.25,8.45 57.45,8.45 57.73,8.18 57.73,6.88 | D3.1 67.35,5.6 67.2,5.45 62.55,5.45 62.25,5.75 62.25,7 61.92,7.33 U$5.P$1
  Top 0.305: 67.35,7.55 D3.1
VIN_BAT  (via drill 0.3)
  Top 0.152: R6-ESP.2 38.75,4.25 38.95,4.05 45.05,4.05 45.65,4.65 v47.5,4.65 | C2_BAT.2 U3.3
  Top 0.305: C2_BAT.2 U$4.P$5 | U$4.P$2 67.51,10.16 67.1,9.75 Q1.3
  Top 0.508: U$4.P$2 62.56,11.76 | 62.56,11.76 U$4.P$5 | U$4.P$6 60.01,10.91 60.86,11.76 62.56,11.76
  Bottom 0.152: U$4.P$6 48.46,9.21 48.15,8.9 48.15,5.31 v47.5,4.66 v47.5,4.65 44.18,4.65 43.17,3.64 39.84,3.64 38.73,2.53 J1.13
VIN_USB  (via drill 0.3)
  Top 0.152: U4.15 53.88,15.73 54.05,15.91 54.05,16.15 54.25,16.35 C5_USB.1 C4_USB.1 v54.85,19 | U3.4 C1_BAT.2 70.35,13.65 70.5,13.5 72.6,13.5 73,13.1 | 69.65,8.6 PFMF.050.2.1 v69.65,4.9 | Q1.1 65.35,7.4 65.25,7.5 R1_PWRUSB.2 | 65.35,6.35 D3.2
  Top 0.305: LED_BAT.A 73,13.1 73,11.03 72.65,10.68 69.93,10.68 69.65,10.4 69.65,8.6 65.55,8.6 65.35,8.4 Q1.1 | 65.35,7.4 65.35,6.35
  Bottom 0.152: J1.14 41.27,2.52 42.09,3.34 43.29,3.34 44.08,4.12 54.13,4.12 55.15,3.1 56.7,3.1 57.72,4.12 68.87,4.12 v69.64,4.9 v69.65,4.9 69.65,19.45 68.9,20.2 55.3,20.2 54.85,19.75 v54.85,19
VUSB
  Top 0.152: MOLEX.1 75.3,10.46 74.74,9.9 C3_USB.1 74.05,7.25 PFMF.050.2.2
XTAL_N
  Top 0.152: U$3.P$44 28.38,11.57 28.05,11.9 26.93,11.9 26.76,11.74 24.36,11.74 24.2,11.9 Q40M.3 C2-Q1.2
XTAL_P
  Top 0.152: U$3.P$45 28.27,11.22 27.9,11.6 27.05,11.6 26.85,11.4 25.77,11.4 25.5,11.12 Q40M.1 C1-Q1.2

### Text on the board
bPlace: MISO | GND | MOSI | SCK | 5 | 8 | 7 | 6 | 11 | 10 | 9 | 17 | VDDIO_SDIO | 16 | 4 | GND | GND | SDA | SCL | 35 | 2 | 12 | 14 | 15 | GND | 3V3 | GND | VIN_BAT | VIN_USB | GND